# Altium schematic sheet Drive 21.04.33.SchDoc
size 177 x 101 mm; SheetNumber: 1; SheetTotal: 1
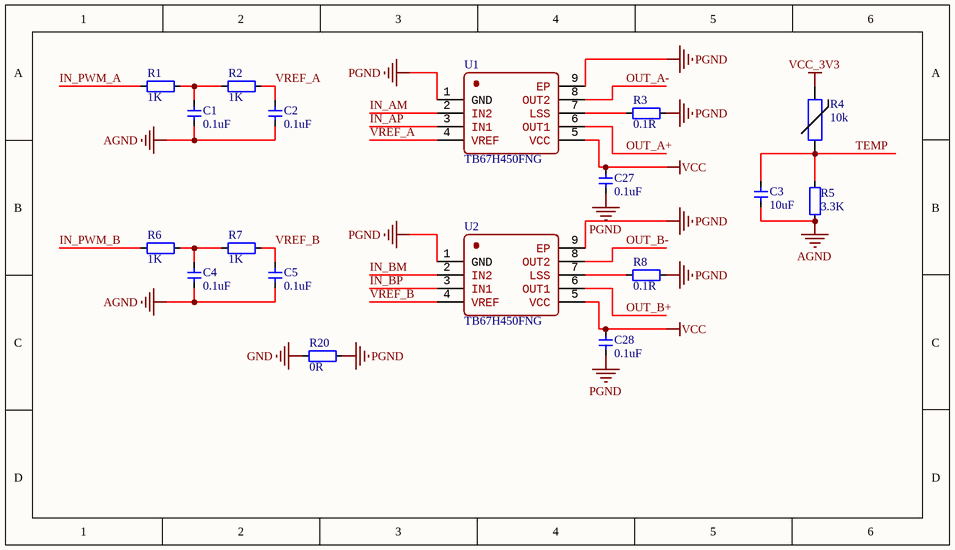
[diagram p0: Drive 21.04.33.SchDoc]

## Parts
C1  0.1uF  [CAP_0402]
C2  0.1uF  [CAP_0402]
C3  10uF  [CAP_0402]
C4  0.1uF  [CAP_0402]
C5  0.1uF  [CAP_0402]
C27  0.1uF  [CAP_0402]
C28  0.1uF  [CAP_0402]
R1  1K  [RES_0402]
R2  1K  [RES_0402]
R3  0.1R  [1206-RES]
R4  value 10k  [RES_0402]  (hidden comment: NCP15XH103F03RC)
R5  3.3K  [RES_0402]
R6  1K  [RES_0402]
R7  1K  [RES_0402]
R8  0.1R  [1206-RES]
R20  0R  [1206-RES]
U1  TB67H450FNG  [SO-8-PAD]
U2  TB67H450FNG  [SO-8-PAD]

## Nets
AGND: C1.1 C2.1 C3.1 C4.1 C5.1 R5.1
GND: R20.1
PGND: C27.1 C28.1 R3.2 R8.2 R20.2 U1.1(GND) U1.9(EP) U2.1(GND) U2.9(EP)
VCC: C27.2 C28.2 U1.5(VCC) U2.5(VCC)
VCC_3V3: R4.2
IN_AM: U1.2(IN2)
IN_AP: U1.3(IN1)
IN_BM: U2.2(IN2)
IN_BP: U2.3(IN1)
IN_PWM_A: R1.1
IN_PWM_B: R6.1
OUT_A+: U1.6(OUT1)
OUT_A-: U1.8(OUT2)
OUT_B+: U2.6(OUT1)
OUT_B-: U2.8(OUT2)
TEMP: C3.2 R4.1 R5.2
VREF_A: C2.2 R2.2 U1.4(VREF)
VREF_B: C5.2 R7.2 U2.4(VREF)
NetC1_2: C1.2 R1.2 R2.1
NetC4_2: C4.2 R6.2 R7.1
NetR3_1: R3.1 U1.7(LSS)
NetR8_1: R8.1 U2.7(LSS)

## Library data of the parts
C1-C5 C27 C28 = 电容-0402: Capacitor; Value: 0.1u
R1 R2 R5-R7 = 电阻-0402: Resistor; Value: 22R
R3 R8 = 电阻-1206: Resistor; Value: 22R
R4 = NCP15XH103F03RC: THERMISTOR 10K OHM NTC 0402 SMD
R20 = 电阻-1206: Resistor; Value: 0R
U1 U2 = TB67H450FNG: PWM Chopper Type DC Brushed Motor Driver